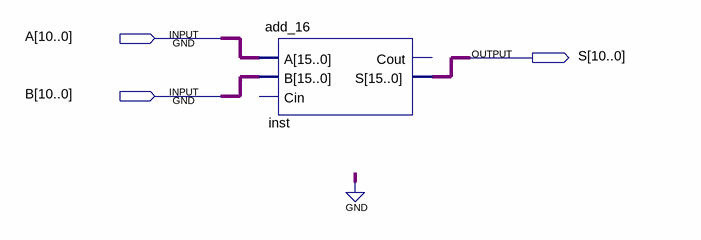
[diagram p0: schematic sheet]
// Quartus schematic add_11.bdf as structural Verilog: 1 symbols, 3 pins
module add_11 (
  input  [10:0] A,
  input  [10:0] B,
  output [15:0] S
);

  add_16 inst (.A({{5{1'b0}}, A}), .B({{5{1'b0}}, B}), .S(S));  // open: Cin, Cout
endmodule
